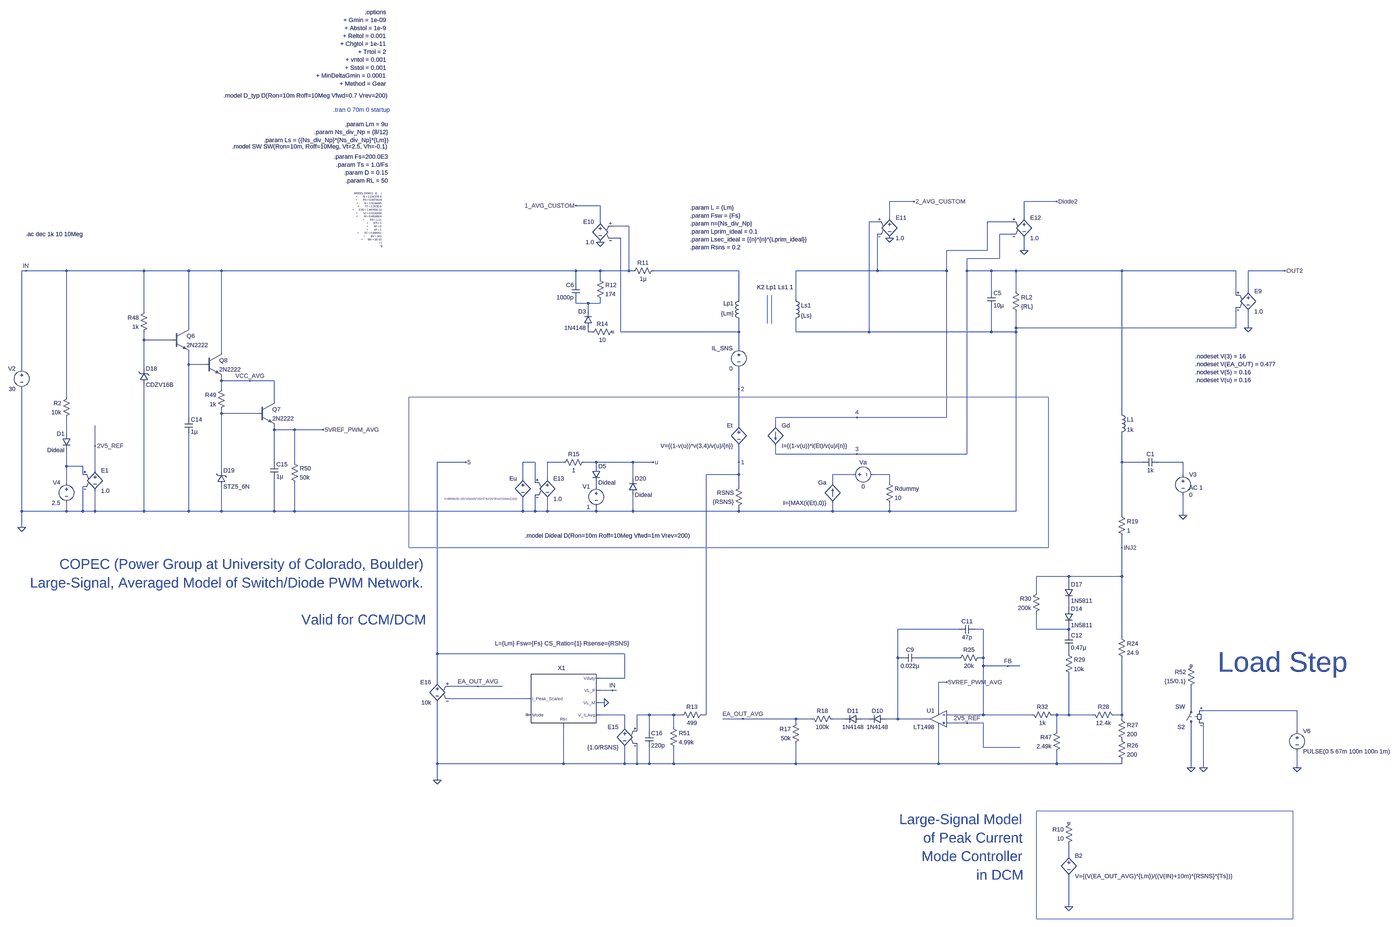
[diagram p0: schematic Flyback_Basic_Model_COPEC_Avgd_PWM_Switch_Diode_with_Correct_CCM_DCM_Peak_Current_Mode_Feedback_AC_Model.asc, whole sheet]
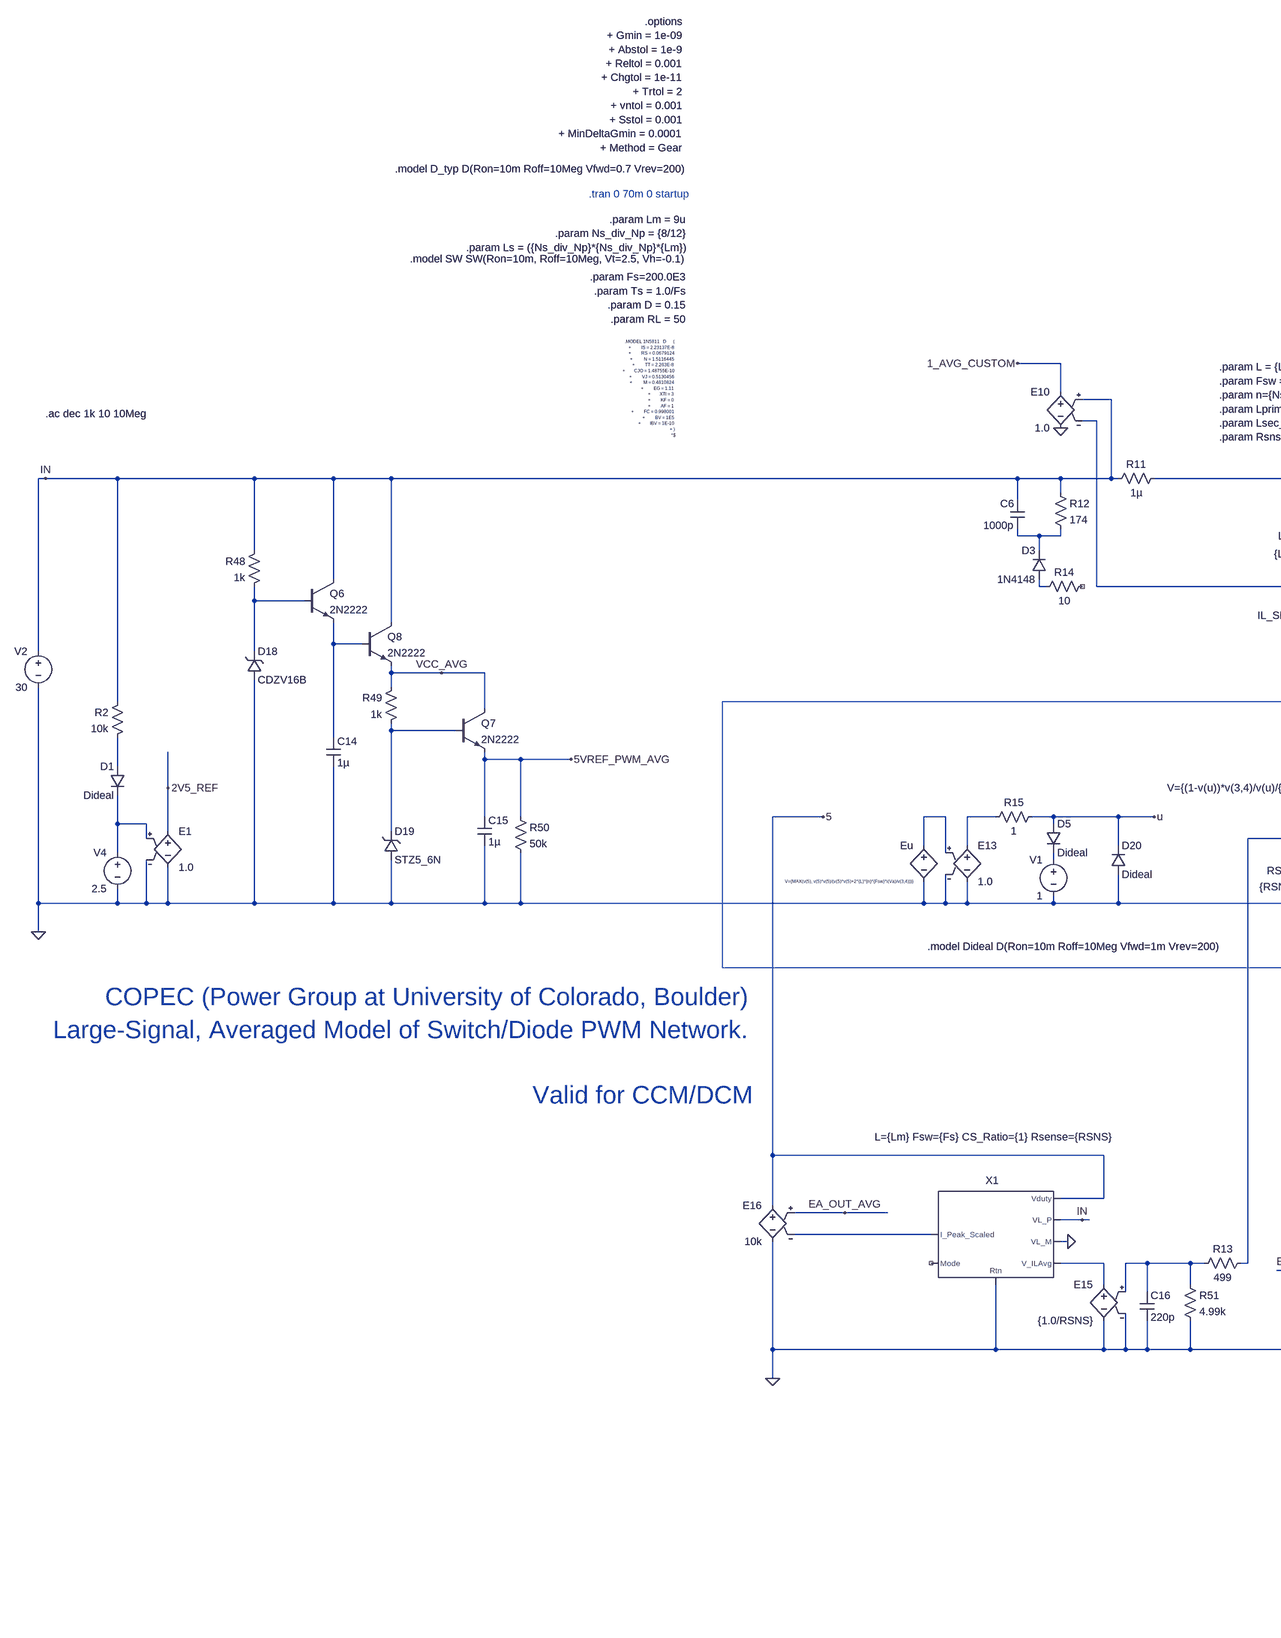
[diagram p1: schematic Flyback_Basic_Model_COPEC_Avgd_PWM_Switch_Diode_with_Correct_CCM_DCM_Peak_Current_Mode_Feedback_AC_Model.asc, part, row 1 of 1, column 1 of 2]
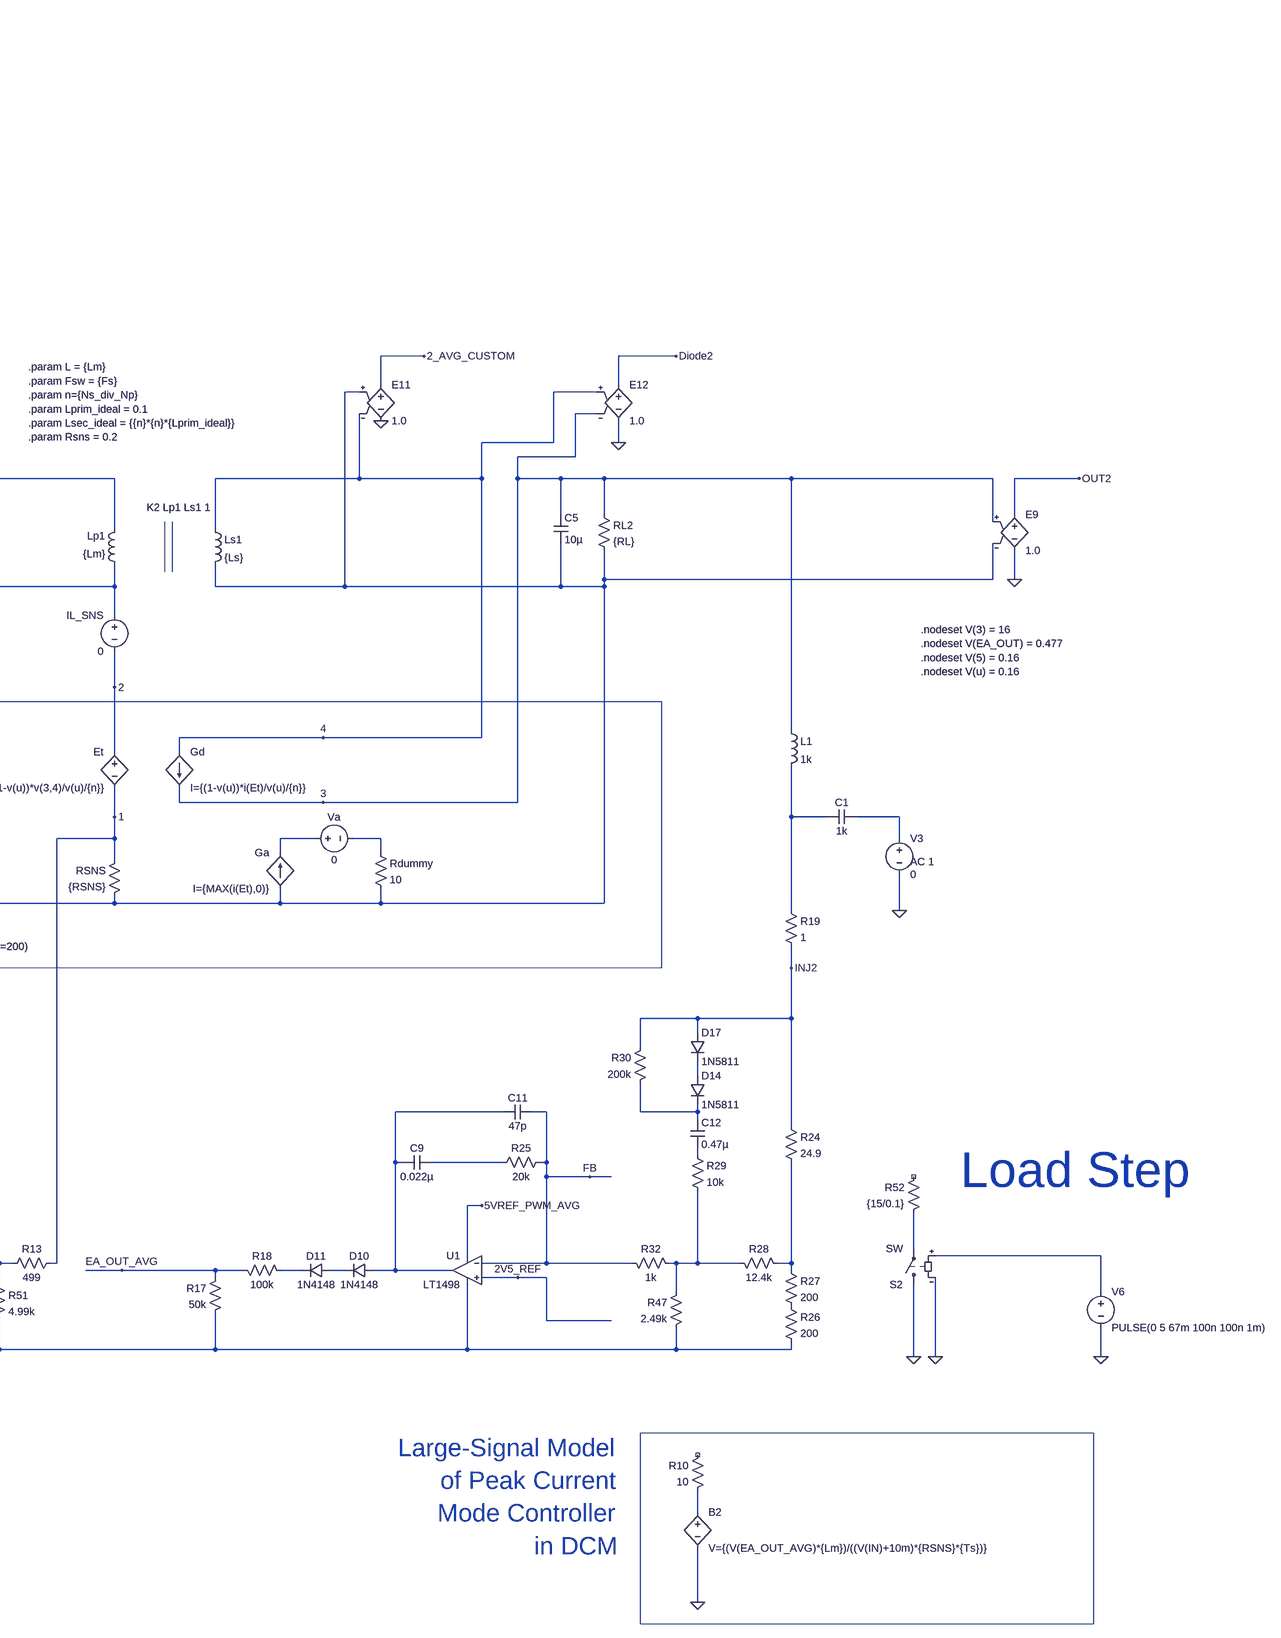
[diagram p2: schematic Flyback_Basic_Model_COPEC_Avgd_PWM_Switch_Diode_with_Correct_CCM_DCM_Peak_Current_Mode_Feedback_AC_Model.asc, part, row 1 of 1, column 2 of 2]
Flyback_Basic_Model_COPEC_Avgd_PWM_Switch_Diode_with_Correct_CCM_DCM_Peak_Current_Mode_Feedback_AC_Model.asc, the LTspice schematic file:
Version 4.1
SHEET 1 6480 5380
WIRE 3824 944 3728 944
WIRE 4384 944 4256 944
WIRE 2592 960 2496 960
WIRE 3728 1008 3728 944
WIRE 4256 1008 4256 944
WIRE 2592 1024 2592 960
WIRE 3680 1024 3648 1024
WIRE 4208 1024 4112 1024
WIRE 2704 1040 2640 1040
WIRE 4208 1072 4160 1072
WIRE 2672 1088 2640 1088
WIRE 4112 1136 4112 1024
WIRE 4112 1136 3952 1136
WIRE 4256 1136 4256 1088
WIRE 4160 1168 4160 1072
WIRE 4160 1168 4032 1168
WIRE 336 1216 320 1216
WIRE 496 1216 336 1216
WIRE 800 1216 496 1216
WIRE 976 1216 800 1216
WIRE 1104 1216 976 1216
WIRE 2496 1216 1104 1216
WIRE 2592 1216 2496 1216
WIRE 2704 1216 2704 1040
WIRE 2704 1216 2592 1216
WIRE 2720 1216 2704 1216
WIRE 3136 1216 2800 1216
WIRE 3680 1216 3680 1072
WIRE 3680 1216 3360 1216
WIRE 3952 1216 3952 1136
WIRE 3952 1216 3680 1216
WIRE 4032 1216 4032 1168
WIRE 4128 1216 4032 1216
WIRE 4224 1216 4128 1216
WIRE 4640 1216 4224 1216
WIRE 5088 1216 4640 1216
WIRE 5280 1216 5136 1216
WIRE 2592 1248 2592 1216
WIRE 2496 1264 2496 1216
WIRE 4128 1296 4128 1216
WIRE 4224 1296 4224 1216
WIRE 5136 1296 5136 1216
WIRE 5088 1312 5088 1216
WIRE 3136 1328 3136 1216
WIRE 3360 1328 3360 1216
WIRE 2496 1344 2496 1328
WIRE 2544 1344 2496 1344
WIRE 2592 1344 2592 1328
WIRE 2592 1344 2544 1344
WIRE 800 1376 800 1216
WIRE 2544 1376 2544 1344
WIRE 976 1440 976 1216
WIRE 4224 1440 4224 1376
WIRE 5088 1440 5088 1360
WIRE 5088 1440 4224 1440
WIRE 5136 1440 5136 1376
WIRE 2544 1456 2544 1440
WIRE 2560 1456 2544 1456
WIRE 2672 1456 2672 1088
WIRE 3136 1456 3136 1408
WIRE 3136 1456 2672 1456
WIRE 3360 1456 3360 1408
WIRE 3648 1456 3648 1024
WIRE 3648 1456 3360 1456
WIRE 4128 1456 4128 1360
WIRE 4128 1456 3648 1456
WIRE 4224 1456 4224 1440
WIRE 4224 1456 4128 1456
WIRE 800 1488 800 1456
WIRE 912 1488 800 1488
WIRE 3136 1520 3136 1456
WIRE 1104 1536 1104 1216
WIRE 976 1584 976 1536
WIRE 1040 1584 976 1584
WIRE 320 1600 320 1216
WIRE 800 1600 800 1488
WIRE 1104 1648 1104 1632
WIRE 1216 1648 1104 1648
WIRE 1312 1648 1216 1648
WIRE 1104 1680 1104 1648
WIRE 3136 1680 3136 1600
WIRE 496 1712 496 1216
WIRE 1312 1728 1312 1648
WIRE 1104 1776 1104 1760
WIRE 1248 1776 1104 1776
WIRE 4640 1776 4640 1216
WIRE 976 1792 976 1584
WIRE 3600 1792 3280 1792
WIRE 3952 1792 3952 1216
WIRE 3952 1792 3600 1792
WIRE 3136 1824 3136 1680
WIRE 3280 1824 3280 1792
WIRE 1312 1840 1312 1824
WIRE 1392 1840 1312 1840
WIRE 1504 1840 1392 1840
WIRE 496 1856 496 1792
WIRE 608 1904 608 1824
WIRE 3280 1936 3280 1904
WIRE 3600 1936 3280 1936
WIRE 4032 1936 4032 1216
WIRE 4032 1936 3600 1936
WIRE 1312 1968 1312 1840
WIRE 1392 1968 1392 1840
WIRE 2064 1968 1952 1968
WIRE 2336 1968 2288 1968
WIRE 2448 1968 2384 1968
WIRE 2576 1968 2528 1968
WIRE 2720 1968 2576 1968
WIRE 2800 1968 2720 1968
WIRE 3136 1968 3136 1904
WIRE 4640 1968 4640 1856
WIRE 4720 1968 4640 1968
WIRE 4880 1968 4784 1968
WIRE 496 1984 496 1920
WIRE 560 1984 496 1984
WIRE 2576 1984 2576 1968
WIRE 608 2000 608 1904
WIRE 1104 2000 1104 1776
WIRE 560 2016 560 1984
WIRE 3136 2016 3136 1968
WIRE 3136 2016 3008 2016
WIRE 3584 2016 3504 2016
WIRE 3728 2016 3664 2016
WIRE 4880 2016 4880 1968
WIRE 2288 2032 2288 1968
WIRE 2384 2032 2384 1968
WIRE 2720 2032 2720 1968
WIRE 496 2048 496 1984
WIRE 2336 2048 2336 1968
WIRE 3504 2048 3504 2016
WIRE 3728 2048 3728 2016
WIRE 2576 2064 2576 2048
WIRE 3136 2064 3136 2016
WIRE 320 2160 320 1680
WIRE 496 2160 496 2128
WIRE 496 2160 320 2160
WIRE 560 2160 560 2064
WIRE 560 2160 496 2160
WIRE 608 2160 608 2080
WIRE 608 2160 560 2160
WIRE 800 2160 800 1664
WIRE 800 2160 608 2160
WIRE 976 2160 976 1856
WIRE 976 2160 800 2160
WIRE 1104 2160 1104 2064
WIRE 1104 2160 976 2160
WIRE 1312 2160 1312 2032
WIRE 1312 2160 1104 2160
WIRE 1392 2160 1392 2048
WIRE 1392 2160 1312 2160
WIRE 2288 2160 2288 2112
WIRE 2288 2160 1392 2160
WIRE 2336 2160 2336 2096
WIRE 2336 2160 2288 2160
WIRE 2384 2160 2384 2112
WIRE 2384 2160 2336 2160
WIRE 2576 2160 2576 2144
WIRE 2576 2160 2384 2160
WIRE 2720 2160 2720 2096
WIRE 2720 2160 2576 2160
WIRE 3136 2160 3136 2144
WIRE 3136 2160 2720 2160
WIRE 3504 2160 3504 2128
WIRE 3504 2160 3136 2160
WIRE 3728 2160 3728 2128
WIRE 3728 2160 3504 2160
WIRE 4224 2160 4224 1456
WIRE 4224 2160 3728 2160
WIRE 4640 2176 4640 1968
WIRE 4880 2176 4880 2096
WIRE 320 2224 320 2160
WIRE 4640 2304 4640 2256
WIRE 4432 2416 4304 2416
WIRE 4640 2416 4640 2304
WIRE 4640 2416 4432 2416
WIRE 4432 2448 4432 2416
WIRE 4304 2480 4304 2416
WIRE 4432 2544 4432 2512
WIRE 4000 2624 3760 2624
WIRE 4096 2624 4064 2624
WIRE 4304 2624 4304 2560
WIRE 4432 2624 4432 2608
WIRE 4432 2624 4304 2624
WIRE 4432 2640 4432 2624
WIRE 4640 2656 4640 2416
WIRE 1952 2720 1952 1968
WIRE 2688 2720 1952 2720
WIRE 4432 2720 4432 2704
WIRE 3760 2736 3760 2624
WIRE 3776 2736 3760 2736
WIRE 4000 2736 3840 2736
WIRE 4096 2736 4096 2624
WIRE 4096 2736 4080 2736
WIRE 4096 2768 4096 2736
WIRE 4192 2768 4096 2768
WIRE 4240 2768 4192 2768
WIRE 2688 2816 2688 2720
WIRE 2688 2816 2592 2816
WIRE 1952 2832 1952 2720
WIRE 3952 2832 3920 2832
WIRE 2112 2848 2000 2848
WIRE 2208 2848 2112 2848
WIRE 2640 2864 2592 2864
WIRE 2656 2864 2640 2864
WIRE 2304 2896 2000 2896
WIRE 2608 2912 2592 2912
WIRE 4912 2928 4912 2848
WIRE 3920 2944 3920 2832
WIRE 5328 2944 4960 2944
WIRE 2688 2960 2592 2960
WIRE 2784 2960 2736 2960
WIRE 2880 2960 2784 2960
WIRE 2912 2960 2880 2960
WIRE 3008 2960 3008 2016
WIRE 3008 2960 2992 2960
WIRE 4096 2960 4096 2768
WIRE 4096 2960 3952 2960
WIRE 4288 2960 4096 2960
WIRE 4384 2960 4368 2960
WIRE 4432 2960 4432 2800
WIRE 4432 2960 4384 2960
WIRE 4528 2960 4432 2960
WIRE 4640 2960 4640 2736
WIRE 4640 2960 4608 2960
WIRE 3152 2976 3072 2976
WIRE 3360 2976 3152 2976
WIRE 3424 2976 3360 2976
WIRE 3552 2976 3504 2976
WIRE 3648 2976 3616 2976
WIRE 3760 2976 3760 2736
WIRE 3760 2976 3712 2976
WIRE 3888 2976 3760 2976
WIRE 4640 2976 4640 2960
WIRE 3360 2992 3360 2976
WIRE 4032 2992 3952 2992
WIRE 4096 2992 4032 2992
WIRE 2688 3008 2688 2960
WIRE 2880 3008 2880 2960
WIRE 2736 3024 2736 2960
WIRE 2784 3024 2784 2960
WIRE 4384 3024 4384 2960
WIRE 5328 3024 5328 2944
WIRE 4096 3088 4096 2992
WIRE 4240 3088 4096 3088
WIRE 1952 3152 1952 2912
WIRE 2448 3152 2448 3008
WIRE 2448 3152 1952 3152
WIRE 2688 3152 2688 3088
WIRE 2688 3152 2448 3152
WIRE 2736 3152 2736 3072
WIRE 2736 3152 2688 3152
WIRE 2784 3152 2784 3088
WIRE 2784 3152 2736 3152
WIRE 2880 3152 2880 3088
WIRE 2880 3152 2784 3152
WIRE 3360 3152 3360 3072
WIRE 3360 3152 2880 3152
WIRE 3920 3152 3920 3008
WIRE 3920 3152 3360 3152
WIRE 4384 3152 4384 3104
WIRE 4384 3152 3920 3152
WIRE 4640 3152 4640 3136
WIRE 4640 3152 4384 3152
WIRE 4912 3168 4912 3008
WIRE 4960 3168 4960 2992
WIRE 5328 3168 5328 3104
WIRE 1952 3216 1952 3152
WIRE 4432 3664 4432 3616
WIRE 4432 3872 4432 3744
FLAG 5136 1440 0
FLAG 5280 1216 OUT2
FLAG 2592 1104 0
FLAG 3728 1088 0
FLAG 2496 960 1_AVG_CUSTOM
FLAG 3824 944 2_AVG_CUSTOM
FLAG 4256 1136 0
FLAG 4384 944 Diode2
FLAG 2064 1968 5
FLAG 2800 1968 u
FLAG 3600 1792 4
FLAG 3600 1936 3
FLAG 1216 1648 VCC_AVG
FLAG 1504 1840 5VREF_PWM_AVG
FLAG 3952 2832 5VREF_PWM_AVG
FLAG 3152 2976 EA_OUT_AVG
FLAG 4912 3168 0
FLAG 4960 3168 0
FLAG 5328 3168 0
FLAG 3136 1680 2
FLAG 3136 1968 1
FLAG 320 2224 0
FLAG 336 1216 IN
FLAG 4032 2992 2V5_REF
FLAG 4432 3872 0
FLAG 2640 2864 IN
FLAG 1952 3216 0
FLAG 2112 2848 EA_OUT_AVG
FLAG 2608 2912 0
FLAG 4640 2304 INJ2
FLAG 4192 2768 FB
FLAG 608 1904 2V5_REF
FLAG 4880 2176 0
DATAFLAG 4672 1216 ""
DATAFLAG 4160 2960 ""
DATAFLAG 1952 2384 ""
DATAFLAG 2352 1216 ""
DATAFLAG 2720 1968 ""
DATAFLAG 1968 1968 ""
DATAFLAG 3344 2976 ""
DATAFLAG 4192 3088 ""
DATAFLAG 2128 2896 ""
DATAFLAG 2784 2960 ""
SYMBOL res 4208 1280 R0
SYMATTR InstName RL2
SYMATTR Value {RL}
SYMBOL cap 4112 1296 R0
SYMATTR InstName C5
SYMATTR Value 10µ
SYMBOL e 5136 1280 R0
SYMATTR InstName E9
SYMATTR Value 1.0
SYMBOL res 2704 1232 R270
WINDOW 0 32 56 VTop 2
WINDOW 3 0 56 VBottom 2
SYMATTR InstName R11
SYMATTR Value 1µ
SYMBOL e 2592 1008 M0
SYMATTR InstName E10
SYMATTR Value 1.0
SYMBOL e 3728 992 R0
SYMATTR InstName E11
SYMATTR Value 1.0
SYMBOL diode 2560 1440 R180
WINDOW 0 24 64 Left 2
WINDOW 3 24 0 Left 2
SYMATTR InstName D3
SYMATTR Value 1N4148
SYMBOL cap 2512 1264 M0
SYMATTR InstName C6
SYMATTR Value 1000p
SYMBOL res 2576 1232 R0
SYMATTR InstName R12
SYMATTR Value 174
SYMBOL e 4256 992 R0
SYMATTR InstName E12
SYMATTR Value 1.0
SYMBOL res 2656 1440 R90
WINDOW 0 0 56 VBottom 2
WINDOW 3 32 56 VTop 2
SYMATTR InstName R14
SYMATTR Value 10
SYMBOL res 3152 2048 M0
SYMATTR InstName RSNS
SYMATTR Value {RSNS}
SYMBOL bv 2288 2016 M0
WINDOW 3 24 96 Left 0
SYMATTR Value V={MAX(v(5), v(5)*v(5)/(v(5)*v(5)+2*{L}*{n}*{Fsw}*i(Va)/v(3,4)))}
SYMATTR InstName Eu
SYMBOL bv 3136 1808 M0
SYMATTR InstName Et
SYMATTR Value V={(1-v(u))*v(3,4)/v(u)/{n}}
SYMBOL bi 3280 1824 R0
SYMATTR InstName Gd
SYMATTR Value I={(1-v(u))*i(Et)/v(u)/{n}}
SYMBOL bi 3504 2128 R180
WINDOW 0 24 80 Left 2
WINDOW 3 24 0 Left 2
SYMATTR InstName Ga
SYMATTR Value I={MAX(i(Et),0)}
SYMBOL voltage 3568 2016 R270
WINDOW 0 32 56 VTop 2
WINDOW 3 -32 56 VBottom 2
WINDOW 123 0 0 Left 0
WINDOW 39 0 0 Left 0
SYMATTR InstName Va
SYMATTR Value 0
SYMBOL res 3712 2032 R0
SYMATTR InstName Rdummy
SYMATTR Value 10
SYMBOL e 2384 2016 R0
SYMATTR InstName E13
SYMATTR Value 1.0
SYMBOL res 2544 1952 R90
WINDOW 0 0 56 VBottom 2
WINDOW 3 32 56 VTop 2
SYMATTR InstName R15
SYMATTR Value 1
SYMBOL diode 2560 1984 R0
SYMATTR InstName D5
SYMATTR Value Dideal
SYMBOL voltage 2576 2048 M0
WINDOW 123 0 0 Left 0
WINDOW 39 0 0 Left 0
SYMATTR InstName V1
SYMATTR Value 1
SYMBOL diode 3712 2992 M270
WINDOW 0 32 32 VTop 2
WINDOW 3 0 32 VBottom 2
SYMATTR InstName D10
SYMATTR Value 1N4148
SYMBOL diode 3616 2992 M270
WINDOW 0 32 32 VTop 2
WINDOW 3 0 32 VBottom 2
SYMATTR InstName D11
SYMATTR Value 1N4148
SYMBOL res 3376 2976 M0
SYMATTR InstName R17
SYMATTR Value 50k
SYMBOL res 3520 2992 M270
WINDOW 0 32 56 VTop 2
WINDOW 3 0 56 VBottom 2
SYMATTR InstName R18
SYMATTR Value 100k
SYMBOL res 4624 2160 R0
SYMATTR InstName R19
SYMATTR Value 1
SYMBOL res 4624 2640 R0
SYMATTR InstName R24
SYMATTR Value 24.9
SYMBOL cap 3840 2720 R90
WINDOW 0 0 32 VBottom 2
WINDOW 3 32 32 VTop 2
SYMATTR InstName C9
SYMATTR Value 0.022µ
SYMBOL res 4096 2720 R90
WINDOW 0 0 56 VBottom 2
WINDOW 3 32 56 VTop 2
SYMATTR InstName R25
SYMATTR Value 20k
SYMBOL cap 4064 2608 R90
WINDOW 0 0 32 VBottom 2
WINDOW 3 32 32 VTop 2
SYMATTR InstName C11
SYMATTR Value 47p
SYMBOL res 4624 3040 R0
SYMATTR InstName R26
SYMATTR Value 200
SYMBOL res 4624 2960 R0
SYMATTR InstName R27
SYMATTR Value 200
SYMBOL res 4512 2944 M90
WINDOW 0 0 56 VBottom 2
WINDOW 3 32 56 VTop 2
SYMATTR InstName R28
SYMATTR Value 12.4k
SYMBOL res 4416 2704 R0
SYMATTR InstName R29
SYMATTR Value 10k
SYMBOL cap 4416 2640 R0
SYMATTR InstName C12
SYMATTR Value 0.47µ
SYMBOL diode 4416 2544 R0
SYMATTR InstName D14
SYMATTR Value 1N5811
SYMBOL diode 4416 2448 R0
SYMATTR InstName D17
SYMATTR Value 1N5811
SYMBOL res 4320 2464 M0
SYMATTR InstName R30
SYMATTR Value 200k
SYMBOL res 4272 2944 M90
WINDOW 0 0 56 VBottom 2
WINDOW 3 32 56 VTop 2
SYMATTR InstName R32
SYMATTR Value 1k
SYMBOL res 4400 3008 M0
SYMATTR InstName R47
SYMATTR Value 2.49k
SYMBOL zener 784 1664 M180
WINDOW 0 24 64 Left 2
WINDOW 3 24 0 Left 2
SYMATTR InstName D18
SYMATTR Value CDZV16B
SYMBOL res 816 1360 M0
SYMATTR InstName R48
SYMATTR Value 1k
SYMBOL npn 912 1440 R0
SYMATTR InstName Q6
SYMATTR Value 2N2222
SYMBOL cap 960 1792 R0
SYMATTR InstName C14
SYMATTR Value 1µ
SYMBOL zener 1088 2064 M180
WINDOW 0 24 64 Left 2
WINDOW 3 24 0 Left 2
SYMATTR InstName D19
SYMATTR Value STZ5_6N
SYMBOL res 1120 1664 M0
SYMATTR InstName R49
SYMATTR Value 1k
SYMBOL npn 1248 1728 R0
SYMATTR InstName Q7
SYMATTR Value 2N2222
SYMBOL cap 1296 1968 R0
SYMATTR InstName C15
SYMATTR Value 1µ
SYMBOL res 1376 1952 R0
SYMATTR InstName R50
SYMATTR Value 50k
SYMBOL npn 1040 1536 R0
SYMATTR InstName Q8
SYMATTR Value 2N2222
SYMBOL sw 4912 3024 R180
SYMATTR InstName S2
SYMBOL res 4928 2752 M0
SYMATTR InstName R52
SYMATTR Value {15/0.1}
SYMBOL voltage 5328 3008 R0
WINDOW 123 0 0 Left 0
WINDOW 39 0 0 Left 0
SYMATTR InstName V6
SYMATTR Value PULSE(0 5 67m 100n 100n 1m)
SYMBOL voltage 3136 1504 M0
WINDOW 123 0 0 Left 0
WINDOW 39 0 0 Left 0
SYMATTR InstName IL_SNS
SYMATTR Value 0
SYMBOL ind 3152 1424 R180
WINDOW 0 36 80 Left 2
WINDOW 3 36 40 Left 2
SYMATTR InstName Lp1
SYMATTR Value {Lm}
SYMATTR Type ind
SYMBOL ind 3344 1312 R0
SYMATTR InstName Ls1
SYMATTR Value {Ls}
SYMATTR Type ind
SYMBOL res 4448 3520 M0
SYMATTR InstName R10
SYMATTR Value 10
SYMBOL bv 4432 3648 R0
SYMATTR InstName B2
SYMATTR Value V={(V(EA_OUT_AVG)*{Lm})/((V(IN)+10m)*{RSNS}*{Ts})}
SYMBOL Peak_Current_Sense 2448 2896 M0
WINDOW 39 7 -201 Bottom 2
SYMATTR SpiceLine L={Lm} Fsw={Fs} CS_Ratio={1} Rsense={RSNS}
SYMATTR InstName X1
SYMBOL e 1952 2816 M0
SYMATTR InstName E16
SYMATTR Value 10k
SYMBOL diode 2704 2096 M180
WINDOW 0 24 64 Left 2
WINDOW 3 24 0 Left 2
SYMATTR InstName D20
SYMATTR Value Dideal
SYMBOL res 3008 2944 R90
WINDOW 0 0 56 VBottom 2
WINDOW 3 32 56 VTop 2
SYMATTR InstName R13
SYMATTR Value 499
SYMBOL cap 2768 3024 R0
SYMATTR InstName C16
SYMATTR Value 220p
SYMBOL res 2864 2992 R0
SYMATTR InstName R51
SYMATTR Value 4.99k
SYMBOL e 2688 2992 M0
SYMATTR InstName E15
SYMATTR Value {1.0/RSNS}
SYMBOL voltage 320 1584 M0
WINDOW 123 0 0 Left 0
WINDOW 39 0 0 Left 0
SYMATTR InstName V2
SYMATTR Value 30
SYMBOL voltage 4880 2000 R0
WINDOW 123 24 68 Left 2
WINDOW 39 0 0 Left 0
SYMATTR Value2 AC 1
SYMATTR InstName V3
SYMATTR Value 0
SYMBOL res 512 1696 M0
SYMATTR InstName R2
SYMATTR Value 10k
SYMBOL voltage 496 2032 M0
WINDOW 123 0 0 Left 0
WINDOW 39 0 0 Left 0
SYMATTR InstName V4
SYMATTR Value 2.5
SYMBOL diode 512 1856 M0
SYMATTR InstName D1
SYMATTR Value Dideal
SYMBOL e 608 1984 R0
SYMATTR InstName E1
SYMATTR Value 1.0
SYMBOL OpAmps\\LT1498 3920 2912 M0
SYMATTR InstName U1
SYMBOL ind 4624 1760 R0
SYMATTR InstName L1
SYMATTR Value 1k
SYMBOL cap 4784 1952 R90
WINDOW 0 0 32 VBottom 2
WINDOW 3 32 32 VTop 2
SYMATTR InstName C1
SYMATTR Value 1k
TEXT 1768 584 Right 2 ;.tran 0 70m 0 startup
TEXT 1760 728 Right 2 !.model SW SW(Ron=10m, Roff=10Meg, Vt=2.5, Vh=-0.1)
TEXT 1760 768 Right 2 !.param Fs=200.0E3\n.param Ts = 1.0/Fs\n.param D = 0.15\n.param RL = 50
TEXT 1760 528 Right 2 !.model D_typ D(Ron=10m Roff=10Meg Vfwd=0.7 Vrev=200)
TEXT 1760 640 Right 2 !.param Lm = 9u\n.param Ns_div_Np = {8/12}\n.param Ls = ({Ns_div_Np}*{Ns_div_Np}*{Lm})
TEXT 2944 968 Left 2 !.param L = {Lm}\n.param Fsw = {Fs}\n.param n={Ns_div_Np}\n.param Lprim_ideal = 0.1\n.param Lsec_ideal = {{n}*{n}*{Lprim_ideal}}\n.param Rsns = 0.2
TEXT 2296 2256 Left 2 !.model Dideal D(Ron=10m Roff=10Meg Vfwd=1m Vrev=200)
TEXT 1736 912 Right 0 !.MODEL 1N5811   D      (\n+         IS = 2.23137E-8\n+         RS = 0.0679124\n+          N = 1.5116445\n+         TT = 2.263E-8\n+        CJO = 1.48755E-10\n+         VJ = 0.5130456\n+          M = 0.4810824\n+         EG = 1.11\n+        XTI = 3\n+         KF = 0\n+         AF = 1\n+         FC = 0.998001\n+         BV = 1E5\n+        IBV = 1E-10\n+ )\n*$
TEXT 5016 2752 Left 7 ;Load Step
TEXT 1752 200 Right 2 !.options\n+ Gmin = 1e-09\n+ Abstol = 1e-9\n+ Reltol = 0.001\n+ Chgtol = 1e-11\n+ Trtol = 2\n+ vntol = 0.001\n+ Sstol = 0.001\n+ MinDeltaGmin = 0.0001\n+ Method = Gear
TEXT 1912 2368 Right 5 ;COPEC (Power Group at University of Colorado, Boulder)\nLarge-Signal, Averaged Model of Switch/Diode PWM Network.\n \nValid for CCM/DCM
TEXT 3208 1280 Left 2 !K2 Lp1 Ls1 1
TEXT 4256 3520 Right 5 ;Large-Signal Model\nof Peak Current\nMode Controller\nin DCM
TEXT 336 1072 Left 2 !.ac dec 1k 10 10Meg
TEXT 4928 1552 Left 2 !.nodeset V(3) = 16\n.nodeset V(EA_OUT) = 0.477\n.nodeset V(5) = 0.16\n.nodeset V(u) = 0.16
LINE Normal 3248 1424 3248 1312
LINE Normal 3264 1424 3264 1312
RECTANGLE Normal 4352 2304 1840 1712
RECTANGLE Normal 5312 3920 4304 3488

The netlist it stands for:
* Flyback_Basic_Model_COPEC_Avgd_PWM_Switch_Diode_with_Correct_CCM_DCM_Peak_Current_Mode_Feedback_AC_Model.asc
RL2 3 0 {RL}
C5 3 0 10µ
E9 OUT2 0 3 0 1.0
R11 IN N002 1µ
E10 1_AVG_CUSTOM 0 IN N001 1.0
E11 2_AVG_CUSTOM 0 0 4 1.0
D3 N004 N003 1N4148
C6 IN N003 1000p
R12 IN N003 174
E12 Diode2 0 4 3 1.0
R14 NC_01 N004 10
RSNS 1 0 {RSNS}
B§Eu N009 0 V={MAX(v(5), v(5)*v(5)/(v(5)*v(5)+2*{L}*{n}*{Fsw}*i(Va)/v(3,4)))}
B§Et 2 1 V={(1-v(u))*v(3,4)/v(u)/{n}}
B§Gd 4 3 I={(1-v(u))*i(Et)/v(u)/{n}}
B§Ga 0 N014 I={MAX(i(Et),0)}
Va N014 N015 0
Rdummy N015 0 10
E13 N010 0 N009 0 1.0
R15 u N010 1
D5 u N016 Dideal
V1 N016 0 1
D10 N018 N030 1N4148
D11 N030 N029 1N4148
R17 EA_OUT_AVG 0 50k
R18 N029 EA_OUT_AVG 100k
R19 N011 INJ2 1
R24 INJ2 N028 24.9
C9 N021 N018 0.022µ
R25 FB N021 20k
C11 FB N018 47p
R26 P001 0 200
R27 N028 P001 200
R28 N027 N028 12.4k
R29 N020 N027 10k
C12 N019 N020 0.47µ
D14 N017 N019 1N5811
D17 INJ2 N017 1N5811
R30 INJ2 N019 200k
R32 FB N027 1k
R47 N027 0 2.49k
D18 0 N005 CDZV16B
R48 IN N005 1k
Q6 IN N005 N006 0 2N2222
C14 N006 0 1µ
D19 0 N007 STZ5_6N
R49 VCC_AVG N007 1k
Q7 VCC_AVG N007 5VREF_PWM_AVG 0 2N2222
C15 5VREF_PWM_AVG 0 1µ
R50 5VREF_PWM_AVG 0 50k
Q8 IN N006 VCC_AVG 0 2N2222
S2 0 N023 N024 0 SW
R52 NC_02 N023 {15/0.1}
V6 N024 0 PULSE(0 5 67m 100n 100n 1m)
V§IL_SNS N001 2 0
Lp1 N001 N002 {Lm}
Ls1 4 0 {Ls}
R10 NC_03 N031 10
B2 N031 0 V={(V(EA_OUT_AVG)*{Lm})/((V(IN)+10m)*{RSNS}*{Ts})}
X§X1 N022 0 N025 5 0 IN NC_04 Peak_Current_Sense params: L={Lm} Fsw={Fs} CS_Ratio={1} Rsense={RSNS}  ; pins I_Peak_Scaled Rtn V_ILAvg Vduty VL_M VL_P Mode
E16 5 0 EA_OUT_AVG N022 10k
D20 0 u Dideal
R13 1 N026 499
C16 N026 0 220p
R51 N026 0 4.99k
E15 N025 0 N026 0 {1.0/RSNS}
V2 IN 0 30
V3 N012 0 0 AC 1
R2 IN N008 10k
V4 N013 0 2.5
D1 N008 N013 Dideal
E1 2V5_REF 0 N013 0 1.0
X§U1 2V5_REF FB 5VREF_PWM_AVG 0 N018 LT1498  ; pins In+ In- V+ V- OUT
L1 3 N011 1k
C1 N012 N011 1k
.model D D
.lib standard.dio
.model NPN NPN
.model PNP PNP
.lib standard.bjt
* .tran 0 70m 0 startup
.model SW SW(Ron=10m, Roff=10Meg, Vt=2.5, Vh=-0.1)
.param Fs=200.0E3
.param Ts = 1.0/Fs
.param D = 0.15
.param RL = 50
.model D_typ D(Ron=10m Roff=10Meg Vfwd=0.7 Vrev=200)
.param Lm = 9u
.param Ns_div_Np = {8/12}
.param Ls = ({Ns_div_Np}*{Ns_div_Np}*{Lm})
.param L = {Lm}
.param Fsw = {Fs}
.param n={Ns_div_Np}
.param Lprim_ideal = 0.1
.param Lsec_ideal = {{n}*{n}*{Lprim_ideal}}
.param Rsns = 0.2
.model Dideal D(Ron=10m Roff=10Meg Vfwd=1m Vrev=200)
.MODEL 1N5811   D      (
+         IS = 2.23137E-8
+         RS = 0.0679124
+          N = 1.5116445
+         TT = 2.263E-8
+        CJO = 1.48755E-10
+         VJ = 0.5130456
+          M = 0.4810824
+         EG = 1.11
+        XTI = 3
+         KF = 0
+         AF = 1
+         FC = 0.998001
+         BV = 1E5
+        IBV = 1E-10
+ )
*$
* Load Step
.options
+ Gmin = 1e-09
+ Abstol = 1e-9
+ Reltol = 0.001
+ Chgtol = 1e-11
+ Trtol = 2
+ vntol = 0.001
+ Sstol = 0.001
+ MinDeltaGmin = 0.0001
+ Method = Gear
* COPEC (Power Group at University of Colorado, Boulder)
* Large-Signal, Averaged Model of Switch/Diode PWM Network.
* Valid for CCM/DCM
K2 Lp1 Ls1 1
* Large-Signal Model
* of Peak Current
* Mode Controller
* in DCM
.ac dec 1k 10 10Meg
.nodeset V(3) = 16
.nodeset V(EA_OUT) = 0.477
.nodeset V(5) = 0.16
.nodeset V(u) = 0.16
.lib LTC.lib
.backanno
.end